# Altium schematic sheet Board_Power.SchDoc
size A4; SheetNumber: 4; SheetTotal: 6
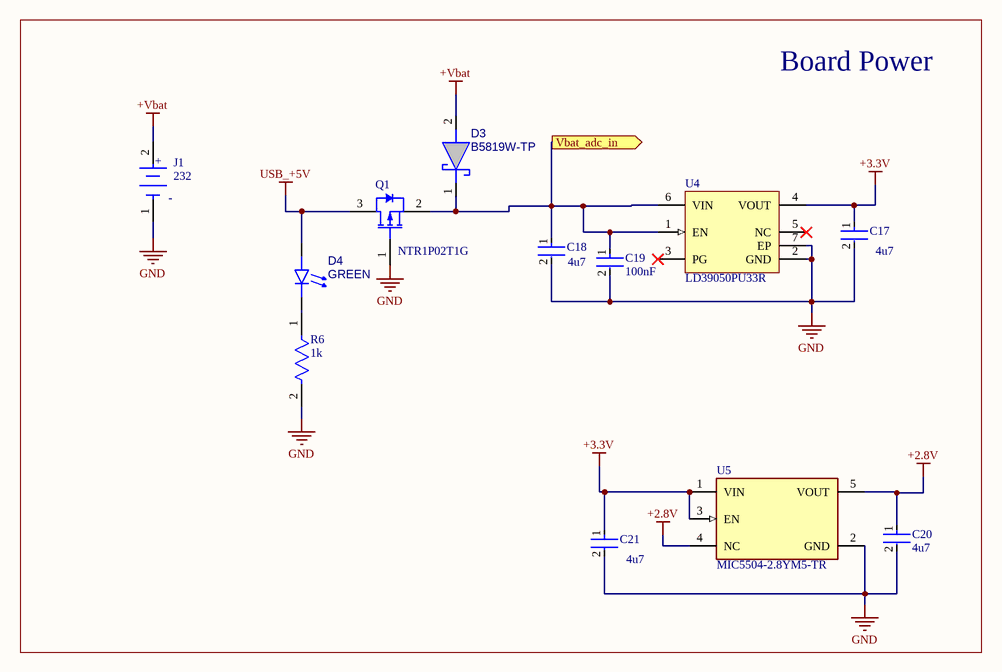
[diagram p0: Board_Power.SchDoc]

## Parts
C17  4u7  [FP-GRM21B-0_15-MFG]
C18  4u7  [FP-GRM21B-0_15-MFG]
C19  100nF  [FP-C1206C-EB-MFG]
C20  4u7  [FP-GRM21B-0_15-MFG]
C21  4u7  [FP-GRM21B-0_15-MFG]
D3  B5819W-TP  [B5819W-TP-Footprint-1]
D4  GREEN  [156120VS75000-Footprint-1]
J1  232  [1043P-Footprint-1]
Q1  NTR1P02T1G  [ONSC-SOT-23-3-318-08_V]
R6  1k  [FP-RMCF1206-MFG]
U4  LD39050PU33R  [DFN6D_L]
U5  MIC5504-2.8YM5-TR  [FP-SOT23-5LD-PL-1-IPC_C]

## Blocks framed on the sheet
Board Power: C17-C21 D3 D4 J1 Q1 R6 U4 U5

## Ports
Vbat_adc_in (out, see MCU[2A], Sheet3[2A], Sheet3[6B])

## Nets
+2.8V: C20.1 U5.4(NC) U5.5(VOUT)
+3.3V: C17.1 C21.1 U4.4(VOUT) U5.1(VIN) U5.3(EN)
+Vbat: D3.2(A) J1.2(A)
GND: C17.2 C18.2 C19.2 C20.2 C21.2 J1.1(C) Q1.1(G) R6.2 U4.2(GND) U4.7(EP) U5.2(GND)
USB_+5V: D4.2(A) Q1.3(D)
Vbat_adc_in: C18.1 C19.1 D3.1(K) Q1.2(S) U4.1(EN) U4.6(VIN) ; port Vbat_adc_in
NetD4_1: D4.1(K) R6.1

Not connected (* = marked no-connect by the designer): U4 3(PG)* 5(NC)*

## Notes on the sheet
- (in symbol CMP-00029-00001-3) +; -

## Library data of the parts
C17 C18 C20 C21 = CMP-06035-005997-1: Chip Multilayer Ceramic Capacitors for General Purpose, 0805, 4.7uF, X7R, 15%, 10%, 10V; Tolerance: 10%; Capacitance: 4.7uF; Width: 1.25mm; Case/Package: 0805; Voltage Rating (DC): 10V; Thickness: 1.25mm; Dielectric: X7R; Length: 2mm
C19 = CMP-03020-021070-1: CAP CER 0.1UF 16V 10% X7R 1206; Manufacturer Part Number: C1206C104K4RACTU; Manufacturer: KEMET; Automotive Grade: Grade 0; Tolerance: 0.1; Temperature Coefficient: 15%; Capacitance: 0.10 μF; Material: Ceramic; Value: 0.10 μF; ComponentLink2URL: https://content.kemet.com/datasheets/KEM_C1007_X8R_ULTRA_150C_SMD.pdf; Voltage Rating: 16 V; Temperature Range Low: -55°C; Device Class L3: Ceramic Capacitors; Device Class L1: Passive Components; Lead Free: Yes; Temperature Characteristic: X7R; Package: C1206C-EB; RoHS: TRUE; Ipc Land Pattern Name: CAPC320160X78; Automotive: Yes; Temperature: -55°C to +150°C; Category: Cap; Digikey Description: CAP CER 0.1UF 16V 10% X7R 1206; Mouser Description: Multilayer Ceramic Capacitors MLCC - SMD/SMT 16volts 0.1uF X7R 10%; ComponentLink2Description: Datasheet; Temperature Range High: +150°C; Device Class L2: Capacitors; Height: 0.88mm; Octopart: https://octopart.com/c1206c104k4ractu-kemet-12577600
D3 = CMP-004-00032-1: Rectifier Diode, Schottky, 1 Phase, 1 Element, 1A, 40V V(RRM), Silicon; Pins: 2; RoHS Compliant: Yes
D4 = CMP-007-00036-1: Single Color LED; RoHS Compliant: Yes
J1 = CMP-00029-00001-3: Batteries/Accessories
Q1 = CMP-1058-00751-1: Power MOSFET, -20 V, -1 A, P-Channel, 3-Pin SOT-23, Pb-Free, Tape and Reel; Manufacturer: On Semiconductor; Ciss Typ (pF): 165; Coss Typ (pF): 110; Qrr Typ (nC): 8; Crss Typ (pF): 35; V(BR)DSS Min (V): 20; VGS(th) Max (V): 2.3; Configuration: Single; ID Max (A): 1; Channel Polarity: P Channel; PD Max (W): 0.4; ComponentLink2Description: Datasheet; ComponentLink3URL: http://www.onsemi.cn/pub_link/Collateral/318-08.PDF; PackageReference: SOT-23-3-318-08; ComponentLink1Description: Manufacturer URL; Mounting Technology: Surface Mount; RoHS: Pb-Free; Package Type: SOT-23-3; DatasheetVersion: Rev. 7; PackageVersion: Rev. AP, 11/2009; Packing: Tape and Reel; PackageDescription: 3-Pin Small Outline Transistor, Body 2.92 x 1.3 mm, Pitch 0.95 mm; VGS Max (V): 20; ComponentLink3Description: Package Specification; ComponentLink1URL: http://www.onsemi.com/; PartNumber: NTR1P02T1G; ComponentLink2URL: http://www.onsemi.cn/pub_link/Collateral/NTR1P02T1-D.PDF
R6 = CMP-26527-000044-1: 1kΩ ±5% 0.25W 1206 Thick Film Chip Resistor AEC-Q200 compliant; Temperature Coefficient: 200ppm/°C; Power Rating: 250mW; Working Voltage: 200V; Resistance: 1kR; Min Operating Temperature: -55°C; Mount: Surface Mount; Number of Terminations: 2; Case Code (Imperial): 1206; Case Code (Metric): 3216; Packaging: Tape and Reel; Tolerance: 5%; Height: 0.028inch; Length: 3.2mm; Features: Automotive AEC-Q200; Depth: 1.6mm; RoHS Compliant: Yes; Resistor Type: Thick Film; Width: 0.063inch; Lead Free: Lead Free; Max Power Dissipation: 250mW; Construction: Rectangular; Case/Package: 1206; Max Operating Temperature: 155°C; Contact Plating: Tin; Radiation Hardening: No; Series: RMCF; Military Standard: Not
U4 = CMP-0244-00288-1: 500 mA Low Quiescent Current Low Noise Voltage Regulator, 3.3V, 6-Pin VDFDPN, Tape and Reel; PackageReference: DFN6D; ComponentLink1Description: Manufacturer URL; ComponentLink1URL: http://www.st.com; PackageVersion: 2008; PackageDescription: 6-Pin Plastic, Dual LLP, 3 x 3 mm Body, 0.95 mm Pitch, Exposed Pad; ComponentLink2URL: http://www.st.com/internet/com/TECHNICAL_RESOURCES/TECHNICAL_LITERATURE/DATASHEET/CD00227527.pdf; DatasheetVersion: 1/03/2009; ComponentLink2Description: Datasheet
U5 = CMP-06324-000050-1: IC REG LINEAR 2.8V 300MA SOT23-5; Min Input Voltage: 2.5V; Output Type: Fixed; Number of Regulators: 1; Max Input Voltage: 5.5V; Min Current Limit: 400mA; Dropout Voltage: 160mV; Max Operating Temperature: 125°C; Mount: Surface Mount; Min Operating Temperature: -40°C; Case/Package: SOT-23-5; Output Current: 300mA; Number of Pins: 5; Nominal Output Voltage: 2.8V; Output Voltage: 2.8V; REACH SVHC: No SVHC; Packaging: Cut Tape